# Altium schematic sheet Wings_pwm.SchDoc
size A4
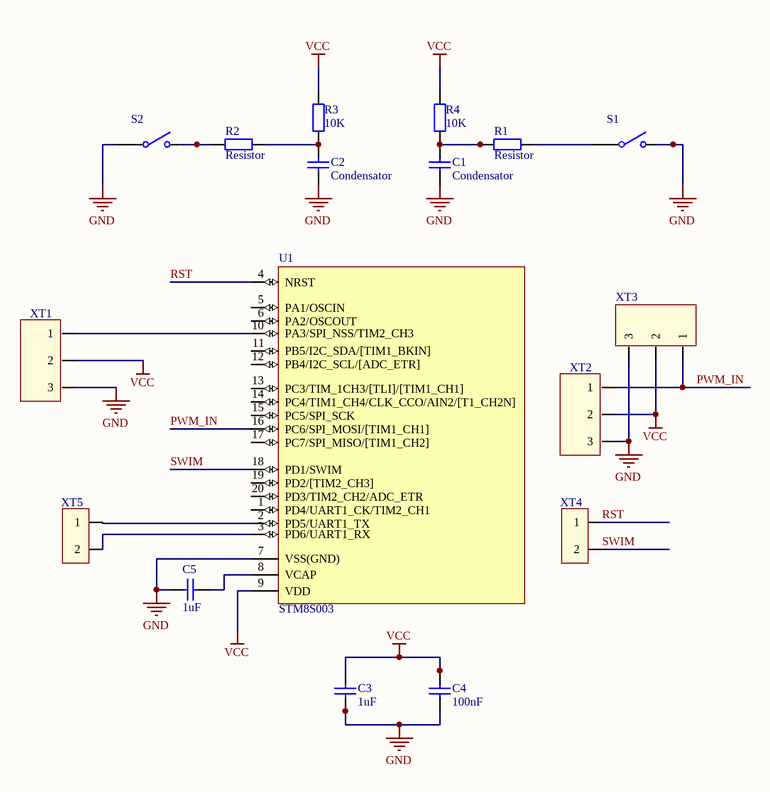
[diagram p0: Wings_pwm.SchDoc]

## Parts
C1  Condensator  [C0603]
C2  Condensator  [C0603]
C3  1uF  [C0603]
C4  100nF  [C0603]
C5  1uF  [C0603]
R1  Resistor  [R0603]
R2  Resistor  [R0603]
R3  10K  [R0603]
R4  10K  [R0603]
S1  *  [Tact_switch_smd]  (value not drawn)
S2  *  [Tact_switch_smd]  (value not drawn)
U1  STM8S003  [STM8S003_TSOP20]
XT1  *  [flat_3pad]  (value not drawn)
XT2  *  [flat_3pad]  (value not drawn)
XT3  *  [flat_3pad]  (value not drawn)
XT4  *  [Pins 2x2.54]  (value not drawn)
XT5  *  [Pins 2x2.54]  (value not drawn)

## Nets
GND: C1.1 C2.1 C3.2 C4.2 C5.2 S1.2(NO) S2.1(COMMON) U1.7(VSS(GND)) XT1.3 XT2.3 XT3.3
VCC: C3.1 C4.1 R3.1 R4.1 U1.9(VDD) XT1.2 XT2.2 XT3.2
PWM_IN: U1.16(PC6/SPI_MOSI/[TIM1_CH1]) XT2.1 XT3.1
RST: U1.4(NRST) XT4.1
SWIM: U1.18(PD1/SWIM) XT4.2
NetC1_2: C1.2 R1.1 R4.2
NetC2_2: C2.2 R2.2 R3.2
NetC5_1: C5.1 U1.8(VCAP)
NetR1_2: R1.2 S1.1(COMMON)
NetR2_1: R2.1 S2.2(NO)
NetU1_2: U1.2(PD5/UART1_TX) XT5.1
NetU1_3: U1.3(PD6/UART1_RX) XT5.2
NetU1_10: U1.10(PA3/SPI_NSS/TIM2_CH3) XT1.1

Not connected (* = marked no-connect by the designer): U1 1(PD4/UART1_CK/TIM2_CH1) 5(PA1/OSCIN) 6(PA2/OSCOUT) 11(PB5/I2C_SDA/[TIM1_BKIN]) 12(PB4/I2C_SCL/[ADC_ETR]) 13(PC3/TIM_1CH3/[TLI]/[TIM1_CH1]) 14(PC4/TIM1_CH4/CLK_CCO/AIN2/[T1_CH2N]) 15(PC5/SPI_SCK) 17(PC7/SPI_MISO/[TIM1_CH2]) 19(PD2/[TIM2_CH3]) 20(PD3/TIM2_CH2/ADC_ETR)

## Library data of the parts
C3-C5 = Condensator
R3 R4 = Resistor
S1 S2 = Tact_switch
XT1-XT3 = Pins 3x2.54
XT4 XT5 = Pins 2x2.54